# EAGLE design Rusnak2 (EAGLE 5.11)
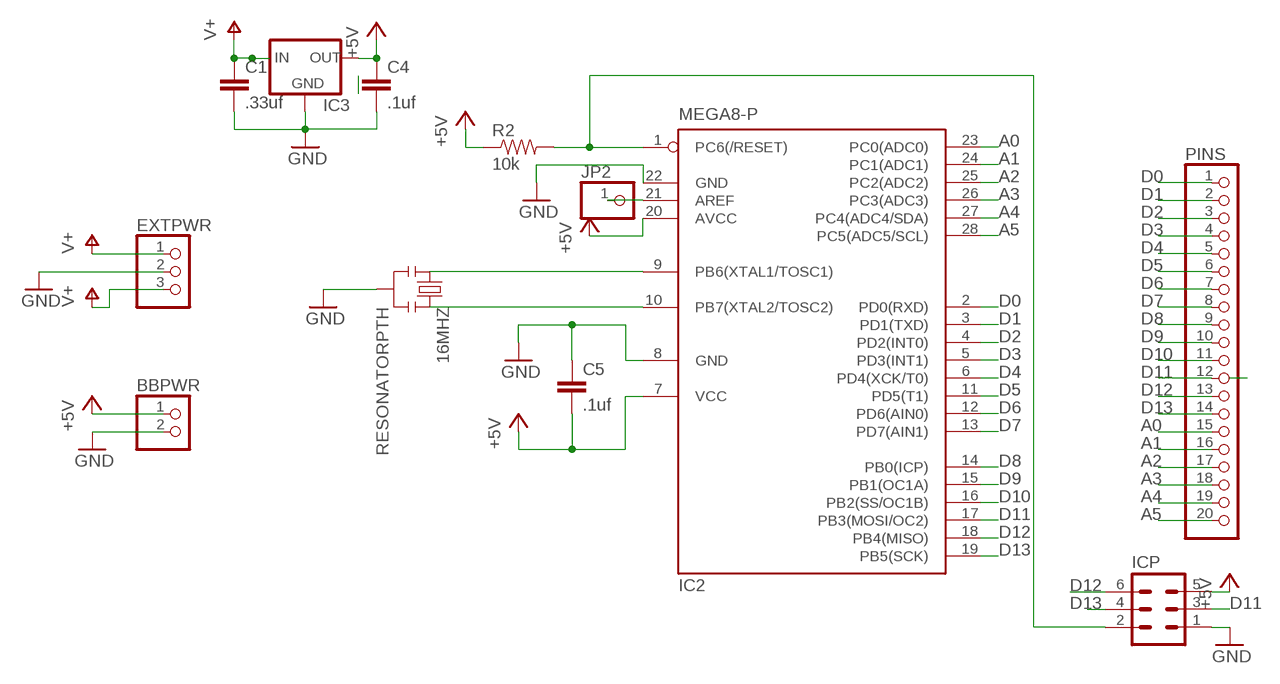
[diagram p0: schematic, sheet 1]

## Parts
16MHZ  RESONATORPTH  [RESONATOR-PTH]
BBPWR  PINHD-1X2  [1X02]
C1  .33uf  CAPPTH3  [CAP-PTH-LARGE]
C4  .1uf  CAPPTH1  [CAP-PTH-5MM]
C5  .1uf  CAPPTH1  [CAP-PTH-5MM]
EXTPWR  PINHD-1X3  [1X03]
IC2  MEGA8-P  [DIL28-3]
IC3  V_REG_78XXTO-92  [TO-92]
ICP  MA03-2  [MA03-2]
JP2  PINHD-1X1  [1X01]
PINS  PINHD-1X20  [1X20]
R2  10k  RESISTORAXIAL-0.3  [AXIAL-0.3]

## Nets
+5V: BBPWR.1 C4.1 C5.2 IC2.7(VCC) IC2.20(AVCC) IC3.3(OUT) ICP.5 R2.P$1
A0: IC2.23(PC0(ADC0)) PINS.15
A1: IC2.24(PC1(ADC1)) PINS.16
A2: IC2.25(PC2(ADC2)) PINS.17
A3: IC2.26(PC3(ADC3)) PINS.18
A4: IC2.27(PC4(ADC4/SDA)) PINS.19
A5: IC2.28(PC5(ADC5/SCL)) PINS.20
D0: IC2.2(PD0(RXD)) PINS.1
D1: IC2.3(PD1(TXD)) PINS.2
D2: IC2.4(PD2(INT0)) PINS.3
D3: IC2.5(PD3(INT1)) PINS.4
D4: IC2.6(PD4(XCK/T0)) PINS.5
D5: IC2.11(PD5(T1)) PINS.6
D6: IC2.12(PD6(AIN0)) PINS.7
D7: IC2.13(PD7(AIN1)) PINS.8
D8: IC2.14(PB0(ICP)) PINS.9
D9: IC2.15(PB1(OC1A)) PINS.10
D10: IC2.16(PB2(SS/OC1B)) PINS.11
D11: IC2.17(PB3(MOSI/OC2)) ICP.3 PINS.12
D12: IC2.18(PB4(MISO)) ICP.6 PINS.13
D13: IC2.19(PB5(SCK)) ICP.4 PINS.14
GND: 16MHZ.2 BBPWR.2 C1.2 C4.2 C5.1 EXTPWR.2 IC2.8(GND) IC2.22(GND) IC3.1(GND) ICP.1
N$2: IC2.21(AREF) JP2.1
N$4: 16MHZ.3 IC2.10(PB7(XTAL2/TOSC2))
N$5: 16MHZ.1 IC2.9(PB6(XTAL1/TOSC1))
N$7: IC2.1(PC6(/RESET)) ICP.2 R2.P$2
V+: C1.1 EXTPWR.1 EXTPWR.3 IC3.2(IN)

## Library data of the parts
16MHZ = SparkFun:RESONATOR: Resonator Small SMD resonator. This is the itty bitty 10/20MHz resonators with built in caps. CSTCE10M0G55 and CSTCE20M0V53. Footprint has been reviewed closely but hasn't been tested yet.
BBPWR = pinhead:PINHD-1X2: PIN HEADER
C1 C4 C5 = SparkFun:CAP: Capacitor Standard 0603 ceramic capacitor, and 0.1" leaded capacitor.
EXTPWR = pinhead:PINHD-1X3: PIN HEADER
IC2 = atmel:MEGA8-P: MICROCONTROLLER 8 Kbytes FLASH, 1 kbytes SRAM, 512 bytes EEPROM, USART, 4-channel 10 bit ADC, 2-channel 8 bit ADC Pin compatible with Atmega48, ATMega88, ATMega168 Source: avr.lbr; OC_FARNELL: unknown; OC_NEWARK: unknown
IC3 = SparkFun:V_REG_78XX: Voltage Regulator Standard 7805 5V regulator. IGO (Input Ground Output). Spark Fun Electronics SKU : COM-00107
ICP = con-lstb:MA03-2: PIN HEADER; OC_FARNELL: unknown; OC_NEWARK: unknown
JP2 = pinhead:PINHD-1X1: PIN HEADER
PINS = pinhead:PINHD-1X20: PIN HEADER
R2 = SparkFun:RESISTOR: Resistor Basic schematic elements and footprints for 0603, 1206, and PTH resistors.

## Board
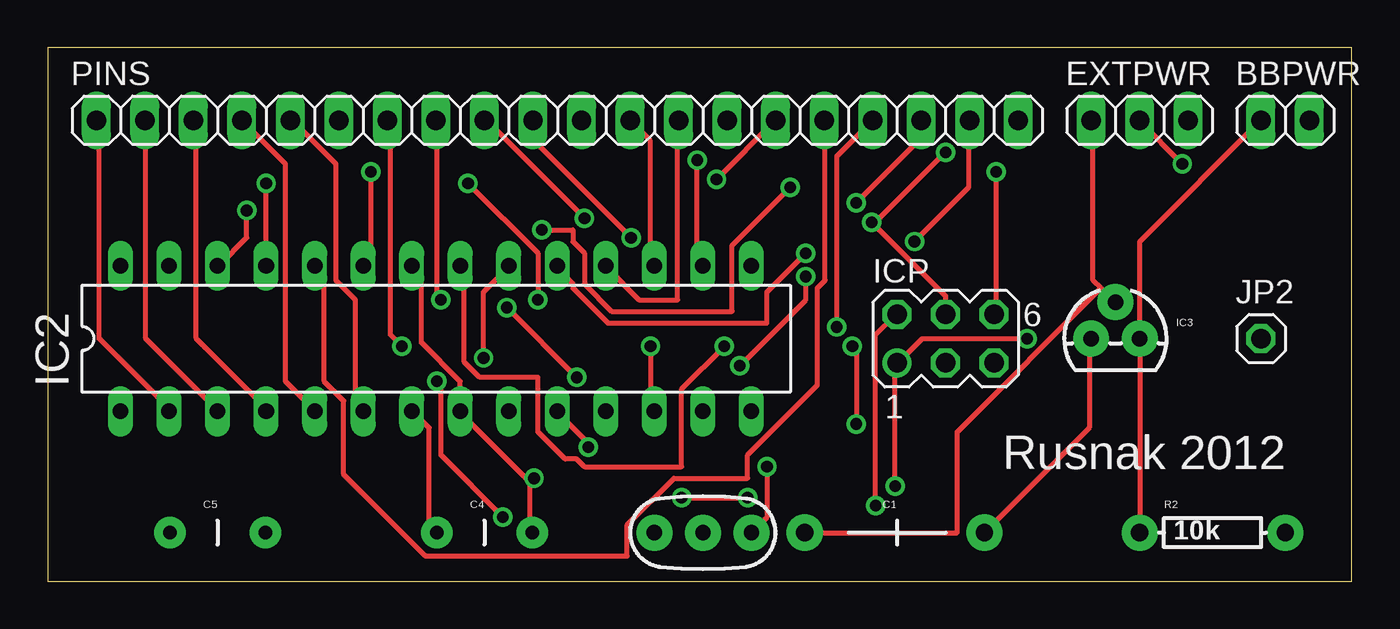
[diagram p1: board, top side]
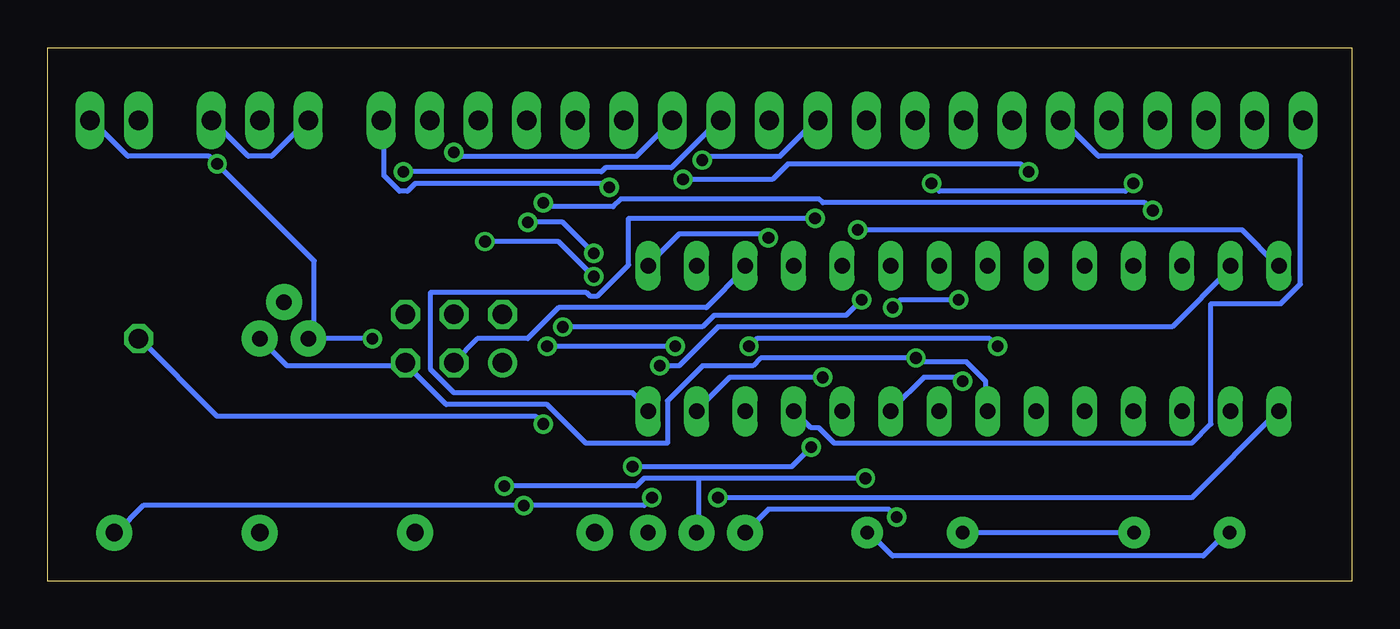
[diagram p2: board, bottom side, seen from below]

Size 68.25 x 27.93 mm. Coordinates in mm from the lower left corner, seen from the top.
Outline: 0,0 68.25,0 68.25,27.93 0,27.93 0,0
Copper layers (1*16): Top 0.035mm / dielectric 1.5mm / Bottom 0.035mm
Design rules "default": minimum track width 10mil, minimum drill 24mil, track to track 8mil, track to pad 8mil, pad to pad 8mil, via to via 8mil, smd to smd 8mil, copper to edge 40mil, drill to drill 8mil, minimum pad ring 10mil, minimum via ring 8mil, stop-mask expansion 4mil, vias tented up to drill 0mil, thermal gap 10mil

### Footprints (pad centres in the part's own frame; a part is rotated, then mirrored left to right if it is on the bottom)
RESONATOR-PTH = drill 0.8 pad 1.88 round: 1 -2.54,0; 2 0,0; 3 2.54,0
1X02 = drill 1.016 long: 1 -1.27,0; 2 1.27,0
CAP-PTH-LARGE = drill 0.9 pad 1.905 round: 1 -4.826,0; 2 4.572,0
CAP-PTH-5MM = drill 0.7 pad 1.651 round: 1 -2.5,0; 2 2.5,0
1X03 = drill 1.016 long: 1 -2.54,0; 2 0,0; 3 2.54,0
DIL28-3 = drill 0.813 long: 1 -16.51,-3.81; 2 -13.97,-3.81; 3 -11.43,-3.81; 4 -8.89,-3.81; 5 -6.35,-3.81; 6 -3.81,-3.81; 7 -1.27,-3.81; 8 1.27,-3.81; 9 3.81,-3.81; 10 6.35,-3.81; 11 8.89,-3.81; 12 11.43,-3.81; 13 13.97,-3.81; 14 16.51,-3.81; 15 16.51,3.81; 16 13.97,3.81; 17 11.43,3.81; 18 8.89,3.81; 19 6.35,3.81; 20 3.81,3.81; 21 1.27,3.81; 22 -1.27,3.81; 23 -3.81,3.81; 24 -6.35,3.81; 25 -8.89,3.81; 26 -11.43,3.81; 27 -13.97,3.81; 28 -16.51,3.81
TO-92 = drill 0.813 pad 1.88 round: 1 -1.27,0; 2 0,1.905; 3 1.27,0
MA03-2 = drill 1.016 round: 1 -2.54,-1.27 | drill 1.016 octagon: 2 -2.54,1.27; 3 0,-1.27; 4 0,1.27; 5 2.54,-1.27; 6 2.54,1.27
1X01 = drill 1.016 octagon: 1 0,0
1X20 = drill 1.016 long: 1 -24.13,0; 2 -21.59,0; 3 -19.05,0; 4 -16.51,0; 5 -13.97,0; 6 -11.43,0; 7 -8.89,0; 8 -6.35,0; 9 -3.81,0; 10 -1.27,0; 11 1.27,0; 12 3.81,0; 13 6.35,0; 14 8.89,0; 15 11.43,0; 16 13.97,0; 17 16.51,0; 18 19.05,0; 19 21.59,0; 20 24.13,0
AXIAL-0.3 = drill 0.9 pad 1.88 round: P$1 -3.81,0; P$2 3.81,0

### Placement (x,y rotation side)
16MHZ  34.29,2.54 0 top
BBPWR  64.77,24.13 0 top
C1  44.45,2.54 0 top
C4  22.86,2.54 0 top
C5  8.89,2.54 0 top
EXTPWR  57.15,24.13 0 top
IC2  20.32,12.7 0 top
IC3  55.88,12.7 0 top
ICP  46.99,12.7 0 top
JP2  63.5,12.7 0 top
PINS  26.67,24.13 0 top
R2  60.96,2.54 0 top

### Tracks (layer width: path | path; a pad name or v marks a point on that pad's centre or on a via)
+5V  (via drill 0.61)
  Top 0.254: IC2.7 19.15,8.84 19.96,8.03 19.96,2.74 20.17,2.54 C4.1 | v22.81,11.68 22.81,15.14 24.03,16.36 IC2.20 | BBPWR.1 57.15,17.78 IC3.3 R2.P$1
  Bottom 0.254: IC2.7 19.15,9.04 19.15,10.46 20.17,11.48 22.61,11.48 v22.81,11.68 30.94,11.68 31.34,11.28 33.99,11.28 35.81,9.45 35.81,7.21 40.08,7.21 42.11,9.25 47.4,9.25 49.43,11.28 ICP.5 49.63,11.28 55.73,11.28 IC3.3 | C5.2 C4.1
A0  (via drill 0.61)
  Top 0.254: v16.92,21.44 16.92,16.97 16.51,16.56 IC2.23 | v35,21.03 PINS.15
  Bottom 0.254: v16.92,21.44 17.32,21.84 29.52,21.84 30.33,21.03 v35,21.03
A1
  Top 0.254: IC2.24 14.07,16.36 14.48,15.95 14.48,10.46 15.49,9.45 15.49,5.59 19.76,1.32 30.33,1.32 30.33,2.95 32.77,5.39 36.63,5.39 36.63,6.6 40.28,10.26 40.28,15.34 40.69,15.75 40.69,24.08 PINS.16
A2  (via drill 0.61)
  Top 0.254: v22,20.83 25.65,17.17 v25.65,14.73 | v41.3,13.31 41.3,22.25 PINS.17 | IC2.25 v11.43,20.83
  Bottom 0.254: v11.43,20.83 11.84,20.42 21.59,20.42 v22,20.83 | v25.65,14.73 26.47,13.92 33.38,13.92 33.99,13.31 v41.3,13.31
A3  (via drill 0.61)
  Top 0.254: v10.41,19.41 10.41,17.98 8.99,16.56 IC2.26 | v42.32,19.81 45.57,23.06 45.57,24.08 PINS.18
  Bottom 0.254: v10.41,19.41 10.82,19.81 27.69,19.81 27.89,20.02 38.25,20.02 38.66,19.61 42.11,19.61 v42.32,19.81
A4  (via drill 0.61)
  Top 0.254: v36.22,11.28 39.68,14.73 v39.68,15.95 | v45.36,17.78 48.21,20.62 48.21,24.08 PINS.19
  Bottom 0.254: v36.22,11.28 35.2,11.28 33.17,13.31 9.4,13.31 6.35,16.36 IC2.27 | v39.68,15.95 41.5,17.78 v45.36,17.78
A5  (via drill 0.61)
  Top 0.254: v25.86,18.39 27.48,18.39 27.48,17.78 28.09,17.17 28.09,15.54 29.52,14.12 35.81,14.12 35.81,17.58 v38.86,20.62
  Bottom 0.254: v25.86,18.39 5.74,18.39 3.91,16.56 IC2.28 | v38.86,20.62 39.07,20.83 49.02,20.83 49.43,20.42 49.84,20.42 50.65,21.23 50.65,24.08 PINS.20
D0
  Top 0.254: IC2.2 6.35,9.04 2.69,12.7 2.69,24.08 PINS.1
D1
  Top 0.254: IC2.3 8.79,9.04 5.13,12.7 5.13,24.08 PINS.2
D2
  Top 0.254: IC2.4 11.43,9.04 7.77,12.7 7.77,24.08 PINS.3
D3
  Top 0.254: IC2.5 13.87,9.04 12.45,10.46 12.45,21.84 PINS.4
D4
  Top 0.254: IC2.6 16.51,9.04 16.1,9.45 16.1,14.73 15.09,15.75 15.09,21.84 12.85,24.08 PINS.5
D5
  Bottom 0.254: IC2.11 29.11,8.84 28.3,8.03 27.89,8.03 27.08,7.21 8.38,7.21 7.37,8.23 7.37,14.53 3.71,14.53 2.69,15.54 2.69,22.25 13.26,22.25 15.09,24.08 PINS.6
D6  (via drill 0.61)
  Top 0.254: v31.55,12.29 31.55,9.25 31.75,9.04 IC2.12 | v18.54,12.29 17.93,12.9 17.93,24.08 PINS.7
  Bottom 0.254: v31.55,12.29 31.14,12.7 18.95,12.7 v18.54,12.29
D7  (via drill 0.61)
  Top 0.254: v24.03,14.33 v27.69,10.67 | v20.57,14.73 20.37,14.93 20.37,24.08 PINS.8
  Bottom 0.254: v27.69,10.67 32.56,10.67 34.19,9.04 IC2.13 | v24.03,14.33 23.62,14.73 v20.57,14.73
D8  (via drill 0.61)
  Top 0.254: v28.09,19 23.01,24.08 PINS.9
  Bottom 0.254: v28.09,19 37.85,19 37.85,16.56 39.47,14.93 39.88,14.93 40.08,15.14 48.21,15.14 48.21,11.07 46.99,9.86 37.64,9.86 36.83,9.04 IC2.14
D9  (via drill 0.61)
  Top 0.254: v30.53,17.98 25.45,23.06 25.45,24.08 PINS.10
  Bottom 0.254: v30.53,17.98 30.73,18.19 35.2,18.19 36.83,16.56 IC2.15
D10  (via drill 0.61)
  Top 0.254: v33.99,22.05 33.99,16.76 34.19,16.56 IC2.16
  Bottom 0.254: v33.99,22.05 33.78,22.25 29.92,22.25 28.09,24.08 PINS.11
D11
  Top 0.254: IC2.17 31.75,16.56 31.55,16.76 31.55,23.06 PINS.12
  Bottom 0.254: ICP.3 46.99,11.48 45.77,12.7 43.13,12.7 41.5,14.33 33.78,14.33 31.75,16.36 IC2.17
D12  (via drill 0.61)
  Top 0.254: IC2.18 29.31,16.36 30.94,14.73 32.97,14.73 32.97,24.08 PINS.13 | v49.63,21.44 49.63,14.12 ICP.6
  Bottom 0.254: v49.63,21.44 39.27,21.44 39.07,21.64 35.61,21.64 33.17,24.08 PINS.13
D13  (via drill 0.61)
  Top 0.254: v39.68,17.17 37.64,15.14 37.64,13.51 29.31,13.51 27.48,15.34 27.48,15.54 26.67,16.36 IC2.19 | 43.33,18.59 46.99,14.93 ICP.4 | v46.99,22.45 43.33,18.8 43.33,18.59 | v43.13,18.8 43.33,18.59
  Bottom 0.254: v39.68,17.17 41.3,18.8 v43.13,18.8 | v46.99,22.45 46.79,22.25 37.44,22.25 PINS.14
GND  (via drill 0.61)
  Top 0.254: 25.25,5.18 21.59,8.84 IC2.8 21.59,10.46 19.56,12.5 19.56,15.95 19.15,16.36 IC2.22 | 25.25,5.18 25.25,2.54 C4.2 | 25.25,5.18 v25.45,5.39 | v59.39,21.84 57.15,24.08 EXTPWR.2 | v51.26,12.7 45.77,12.7 44.55,11.48 ICP.1 44.35,11.28 v44.35,4.98 | C1.2 54.51,8.03 54.51,12.7 IC3.1
  Bottom 0.254: C5.1 6.55,2.54 7.77,1.32 24.03,1.32 25.25,2.54 C4.2 | 34.19,5.39 34.19,2.54 16MHZ.2 | v25.45,5.39 34.19,5.39 | BBPWR.2 65.89,24.08 64.06,22.25 59.79,22.25 v59.39,21.84 54.3,16.76 54.3,12.7 | v51.26,12.7 54.3,12.7 | 54.3,12.7 IC3.1 54.51,12.7 | 34.19,5.39 37.03,5.39 37.44,4.98 v44.35,4.98
N$2  (via drill 0.61)
  Top 0.254: v35.41,12.29 33.17,10.06 33.17,5.99 28.09,5.99 27.69,6.4 27.08,6.4 25.65,7.82 25.65,10.67 22.61,10.67 21.79,11.48 21.79,16.15 21.59,16.36 IC2.21 | v42.11,12.29 42.32,12.09 v42.32,8.23
  Bottom 0.254: v35.41,12.29 v42.11,12.29 | v42.32,8.23 42.72,8.64 59.39,8.64 63.45,12.7 JP2.1
N$4  (via drill 0.61)
  Top 0.254: v28.3,7.01 28.3,7.21 26.67,8.84 IC2.10 | v37.64,5.99 37.64,3.35 16MHZ.3
  Bottom 0.254: v28.3,7.01 29.31,5.99 v37.64,5.99
N$5  (via drill 0.61)
  Top 0.254: v20.37,10.46 20.57,10.26 20.57,6.6 v23.82,3.35
  Bottom 0.254: v20.37,10.46 20.57,10.67 22.4,10.67 24.03,9.04 IC2.9 | v23.82,3.35 24.23,3.76 30.53,3.76 16MHZ.1
N$7  (via drill 0.61)
  Top 0.254: v33.17,4.37 v36.63,4.37 | v43.33,3.96 43.33,12.9 44.35,13.92 ICP.2
  Bottom 0.254: v33.17,4.37 8.38,4.37 3.91,8.84 IC2.1 | v36.63,4.37 37.03,3.96 v43.33,3.96 63.25,3.96 64.67,2.54 R2.P$2
V+
  Top 0.254: 55.12,15.34 54.71,15.75 54.71,24.08 EXTPWR.1 | 55.12,15.34 55.73,14.73 IC3.2 | 55.12,15.34 47.6,7.82 47.6,2.54 C1.1
  Bottom 0.254: EXTPWR.1 54.71,24.08 56.54,22.25 57.76,22.25 59.59,24.08 EXTPWR.3

### Text on the board
tPlace: Rusnak 2012